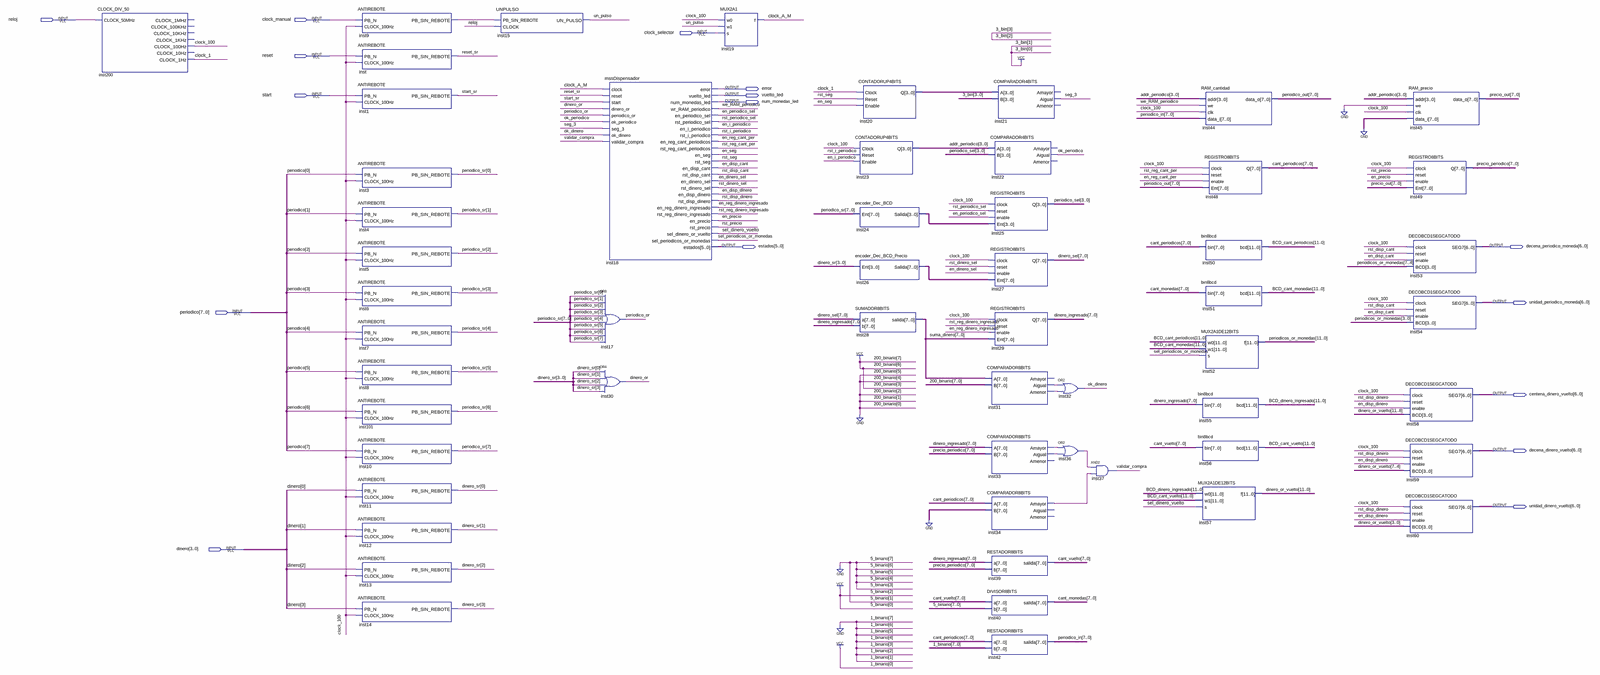
[diagram p0: schematic sheet, whole]
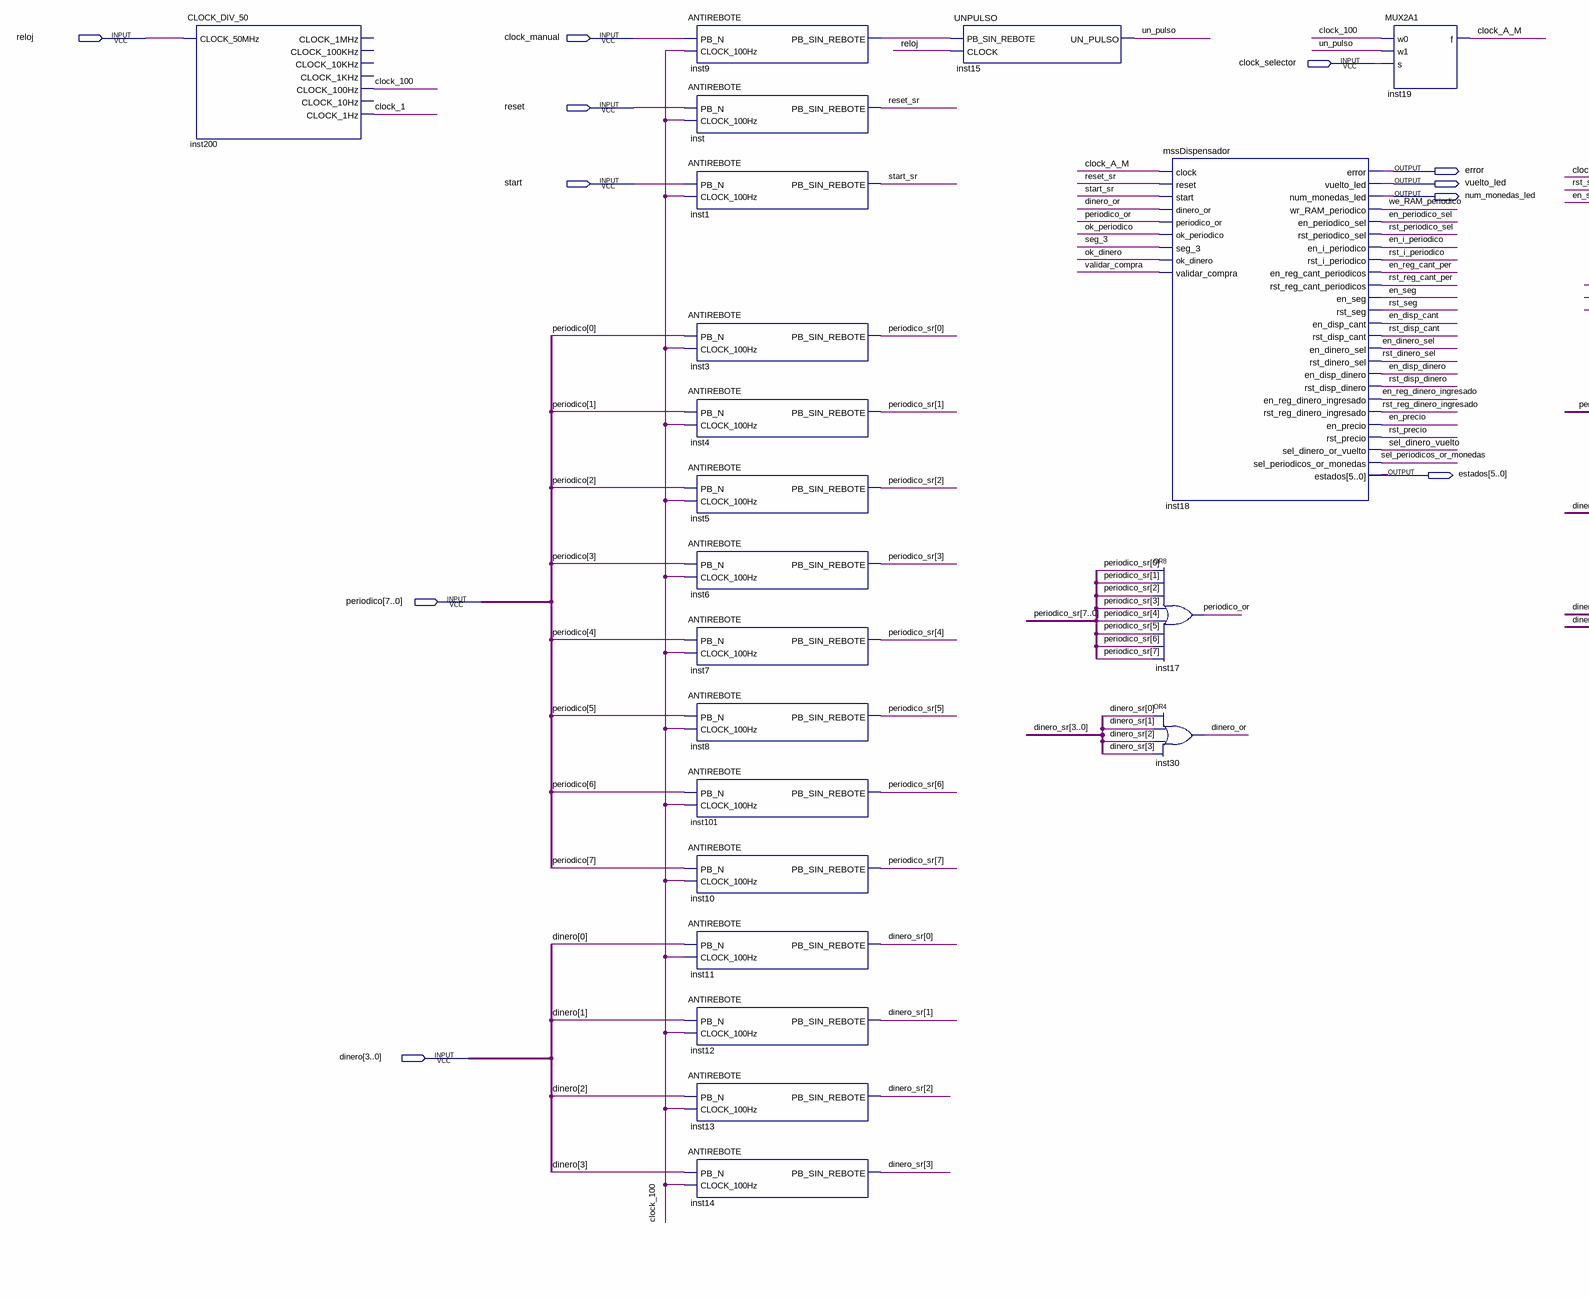
[diagram p1: schematic sheet, left part]
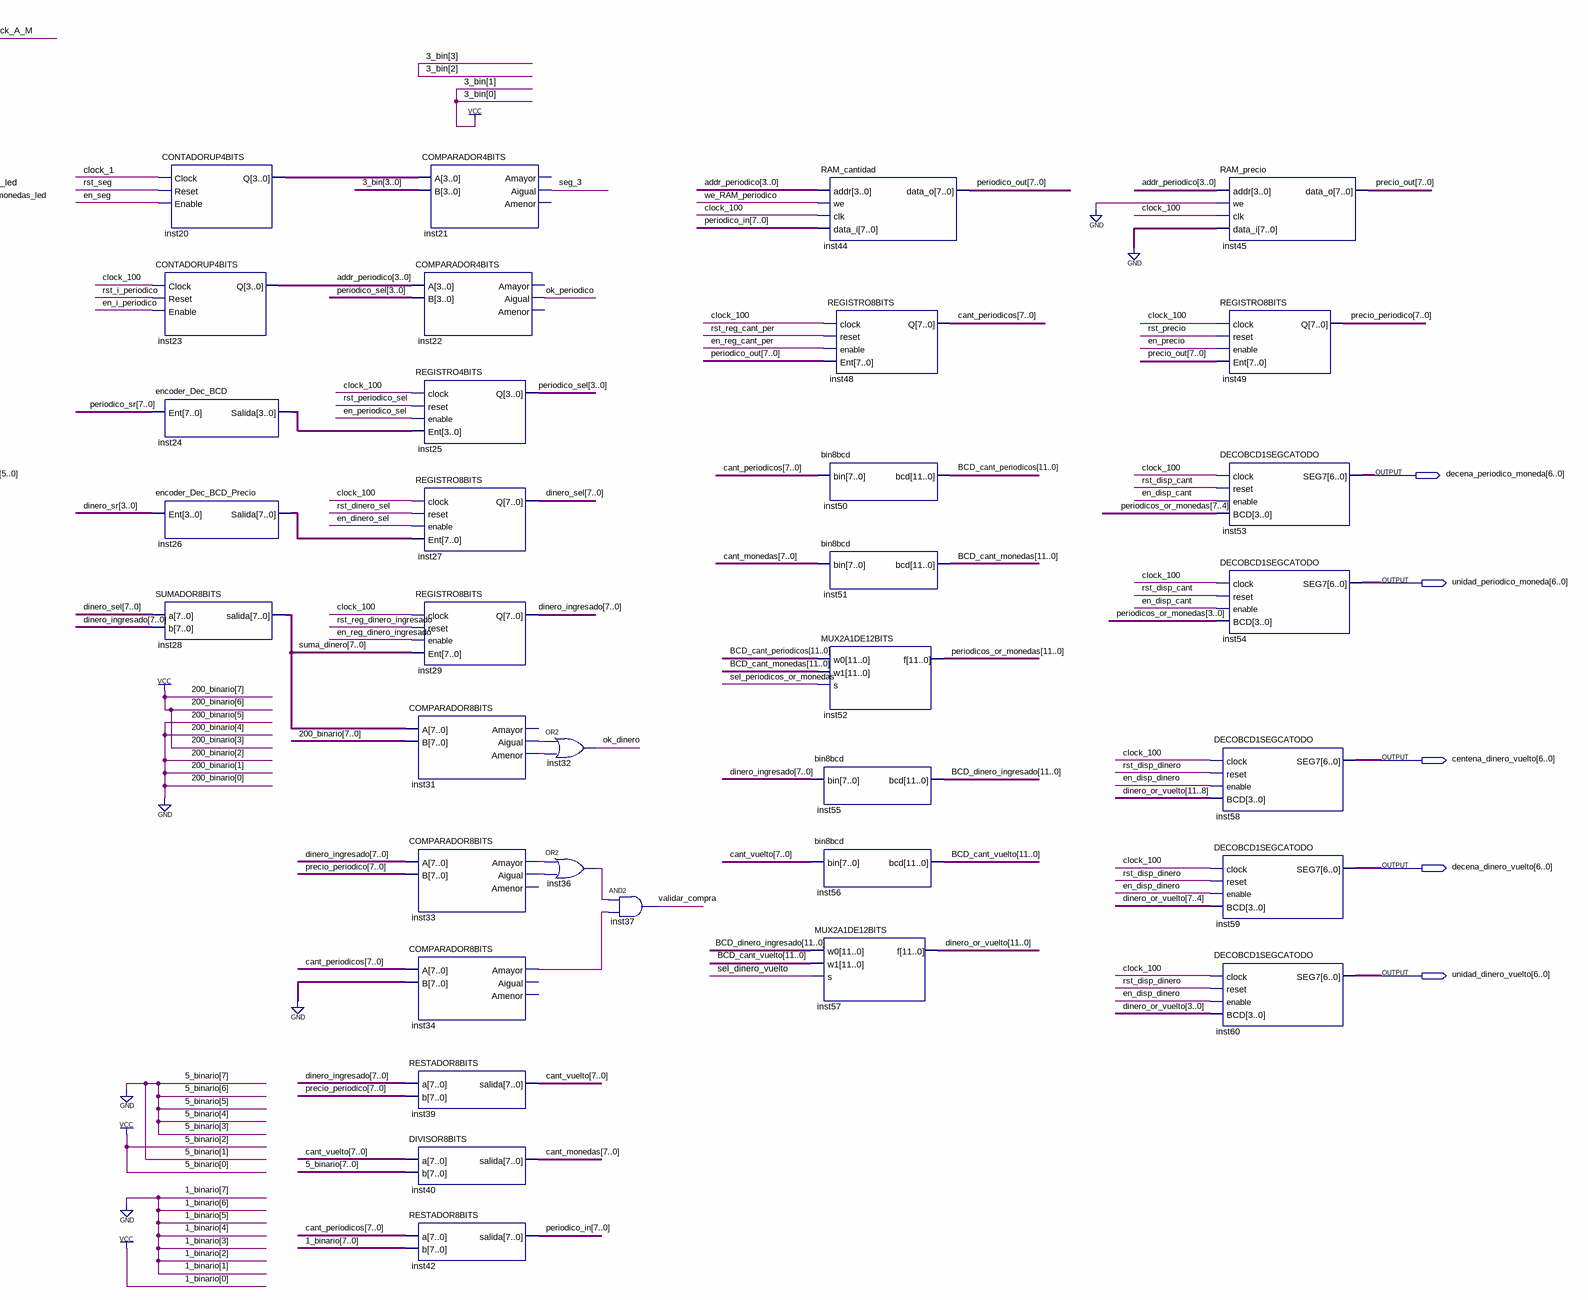
[diagram p2: schematic sheet, right part]
// Quartus schematic proyectoDispensador.bdf as structural Verilog: 55 symbols, 16 pins
module proyectoDispensador (
  input  reloj,
  input  clock_manual,
  input  clock_selector,
  input  reset,
  input  start,
  input  [7:0] periodico,
  input  [3:0] dinero,
  output error,
  output vuelto_led,
  output num_monedas_led,
  output [5:0] estados,
  output [6:0] decena_periodico_moneda,
  output [6:0] unidad_periodico_moneda,
  output [6:0] centena_dinero_vuelto,
  output [6:0] decena_dinero_vuelto,
  output [6:0] unidad_dinero_vuelto
);

  wire clock_1, clock_100, clock_A_M, dinero_or, en_dinero_sel, en_disp_cant, en_disp_dinero, en_i_periodico,
       en_periodico_sel, en_precio, en_reg_cant_per, en_reg_dinero_ingresado, en_seg, inst9_pb_sin_rebote,
       inst31_aigual, inst31_amenor, inst33_aigual, inst33_amayor, inst34_amayor, inst36_out, ok_dinero,
       ok_periodico, periodico_or, reset_sr, rst_dinero_sel, rst_disp_cant, rst_disp_dinero, rst_i_periodico,
       rst_periodico_sel, rst_precio, rst_reg_cant_per, rst_reg_dinero_ingresado, rst_seg, seg_3,
       sel_dinero_vuelto, sel_periodicos_or_monedas, start_sr, un_pulso, validar_compra, we_RAM_periodico;
  wire [3:0] addr_periodico, dinero_sr, inst20_q, inst24_salida, periodico_sel;
  wire [3:3] \3_bin ;
  wire [7:0] cant_monedas, cant_periodicos, cant_vuelto, dinero_ingresado, dinero_sel, inst26_salida,
       periodico_in, periodico_out, periodico_sr, precio_out, precio_periodico, suma_dinero;
  wire [11:0] BCD_cant_monedas, BCD_cant_periodicos, BCD_cant_vuelto, BCD_dinero_ingresado, dinero_or_vuelto,
       periodicos_or_monedas;

  CLOCK_DIV_50 inst200 (
    .CLOCK_50MHz(reloj), .CLOCK_100Hz(clock_100), .CLOCK_1Hz(clock_1));  // open: CLOCK_1MHz, CLOCK_100KHz, CLOCK_10KHz, CLOCK_1KHz, CLOCK_10Hz
  ANTIREBOTE inst9 (.PB_N(clock_manual), .CLOCK_100Hz(clock_100), .PB_SIN_REBOTE(inst9_pb_sin_rebote));
  ANTIREBOTE inst (.PB_N(reset), .CLOCK_100Hz(clock_100), .PB_SIN_REBOTE(reset_sr));
  ANTIREBOTE inst1 (.PB_N(start), .CLOCK_100Hz(clock_100), .PB_SIN_REBOTE(start_sr));
  ANTIREBOTE inst3 (.PB_N(periodico[0]), .CLOCK_100Hz(clock_100), .PB_SIN_REBOTE(periodico_sr[0]));
  ANTIREBOTE inst4 (.PB_N(periodico[1]), .CLOCK_100Hz(clock_100), .PB_SIN_REBOTE(periodico_sr[1]));
  ANTIREBOTE inst5 (.PB_N(periodico[2]), .CLOCK_100Hz(clock_100), .PB_SIN_REBOTE(periodico_sr[2]));
  ANTIREBOTE inst6 (.PB_N(periodico[3]), .CLOCK_100Hz(clock_100), .PB_SIN_REBOTE(periodico_sr[3]));
  ANTIREBOTE inst7 (.PB_N(periodico[4]), .CLOCK_100Hz(clock_100), .PB_SIN_REBOTE(periodico_sr[4]));
  ANTIREBOTE inst8 (.PB_N(periodico[5]), .CLOCK_100Hz(clock_100), .PB_SIN_REBOTE(periodico_sr[5]));
  ANTIREBOTE inst101 (.PB_N(periodico[6]), .CLOCK_100Hz(clock_100), .PB_SIN_REBOTE(periodico_sr[6]));
  ANTIREBOTE inst10 (.PB_N(periodico[7]), .CLOCK_100Hz(clock_100), .PB_SIN_REBOTE(periodico_sr[7]));
  ANTIREBOTE inst11 (.PB_N(dinero[0]), .CLOCK_100Hz(clock_100), .PB_SIN_REBOTE(dinero_sr[0]));
  ANTIREBOTE inst12 (.PB_N(dinero[1]), .CLOCK_100Hz(clock_100), .PB_SIN_REBOTE(dinero_sr[1]));
  ANTIREBOTE inst13 (.PB_N(dinero[2]), .CLOCK_100Hz(clock_100), .PB_SIN_REBOTE(dinero_sr[2]));
  ANTIREBOTE inst14 (.PB_N(dinero[3]), .CLOCK_100Hz(clock_100), .PB_SIN_REBOTE(dinero_sr[3]));
  UNPULSO inst15 (.PB_SIN_REBOTE(inst9_pb_sin_rebote), .CLOCK(reloj), .UN_PULSO(un_pulso));
  mssDispensador inst18 (
    .clock(clock_A_M), .reset(reset_sr), .start(start_sr), .dinero_or(dinero_or),
    .periodico_or(periodico_or), .ok_periodico(ok_periodico), .seg_3(seg_3), .ok_dinero(ok_dinero),
    .validar_compra(validar_compra), .error(error), .vuelto_led(vuelto_led),
    .num_monedas_led(num_monedas_led), .wr_RAM_periodico(we_RAM_periodico),
    .en_periodico_sel(en_periodico_sel), .rst_periodico_sel(rst_periodico_sel),
    .en_i_periodico(en_i_periodico), .rst_i_periodico(rst_i_periodico),
    .en_reg_cant_periodicos(en_reg_cant_per), .rst_reg_cant_periodicos(rst_reg_cant_per), .en_seg(en_seg),
    .rst_seg(rst_seg), .en_disp_cant(en_disp_cant), .rst_disp_cant(rst_disp_cant),
    .en_dinero_sel(en_dinero_sel), .rst_dinero_sel(rst_dinero_sel), .en_disp_dinero(en_disp_dinero),
    .rst_disp_dinero(rst_disp_dinero), .en_reg_dinero_ingresado(en_reg_dinero_ingresado),
    .rst_reg_dinero_ingresado(rst_reg_dinero_ingresado), .en_precio(en_precio), .rst_precio(rst_precio),
    .sel_dinero_or_vuelto(sel_dinero_vuelto), .sel_periodicos_or_monedas(sel_periodicos_or_monedas),
    .estados(estados));
  or inst17 (periodico_or, periodico_sr[0], periodico_sr[1], periodico_sr[2], periodico_sr[3], periodico_sr[4], periodico_sr[5], periodico_sr[6], periodico_sr[7]);
  or inst30 (dinero_or, dinero_sr[0], dinero_sr[1], dinero_sr[2], dinero_sr[3]);
  MUX2A1 inst19 (.w0(clock_100), .w1(un_pulso), .s(clock_selector), .f(clock_A_M));
  CONTADORUP4BITS inst20 (.Clock(clock_1), .Reset(rst_seg), .Enable(en_seg), .Q(inst20_q));
  CONTADORUP4BITS inst23 (.Clock(clock_100), .Reset(rst_i_periodico), .Enable(en_i_periodico), .Q(addr_periodico));
  encoder_Dec_BCD inst24 (.Ent(periodico_sr), .Salida(inst24_salida));
  encoder_Dec_BCD_Precio inst26 (.Ent(dinero_sr), .Salida(inst26_salida));
  SUMADOR8BITS inst28 (.a(dinero_sel), .b(dinero_ingresado), .salida(suma_dinero));
  COMPARADOR4BITS inst21 (.A(inst20_q), .B({{2{\3_bin [3]}}, 2'b11}), .Aigual(seg_3));  // open: Amayor, Amenor
  COMPARADOR4BITS inst22 (.A(addr_periodico), .B(periodico_sel), .Aigual(ok_periodico));  // open: Amayor, Amenor
  REGISTRO4BITS inst25 (
    .clock(clock_100), .reset(rst_periodico_sel), .enable(en_periodico_sel), .Ent(inst24_salida),
    .Q(periodico_sel));
  REGISTRO8BITS inst27 (
    .clock(clock_100), .reset(rst_dinero_sel), .enable(en_dinero_sel), .Ent(inst26_salida), .Q(dinero_sel));
  REGISTRO8BITS inst29 (
    .clock(clock_100), .reset(rst_reg_dinero_ingresado), .enable(en_reg_dinero_ingresado), .Ent(suma_dinero),
    .Q(dinero_ingresado));
  COMPARADOR8BITS inst31 (
    .A(suma_dinero), .B(8'b11001000), .Aigual(inst31_aigual), .Amenor(inst31_amenor));  // open: Amayor
  COMPARADOR8BITS inst33 (
    .A(dinero_ingresado), .B(precio_periodico), .Amayor(inst33_amayor), .Aigual(inst33_aigual));  // open: Amenor
  COMPARADOR8BITS inst34 (.A(cant_periodicos), .B({8{1'b0}}), .Amayor(inst34_amayor));  // open: Aigual, Amenor
  RESTADOR8BITS inst39 (.a(dinero_ingresado), .b(precio_periodico), .salida(cant_vuelto));
  DIVISOR8BITS inst40 (.a(cant_vuelto), .b(8'b00000101), .salida(cant_monedas));
  RESTADOR8BITS inst42 (.a(cant_periodicos), .b(8'b00000001), .salida(periodico_in));
  or inst32 (ok_dinero, inst31_aigual, inst31_amenor);
  or inst36 (inst36_out, inst33_amayor, inst33_aigual);
  and inst37 (validar_compra, inst36_out, inst34_amayor);
  RAM_cantidad inst44 (
    .addr(addr_periodico), .we(we_RAM_periodico), .clk(clock_100), .data_i(periodico_in),
    .data_o(periodico_out));
  REGISTRO8BITS inst48 (
    .clock(clock_100), .reset(rst_reg_cant_per), .enable(en_reg_cant_per), .Ent(periodico_out),
    .Q(cant_periodicos));
  bin8bcd inst50 (.bin(cant_periodicos), .bcd(BCD_cant_periodicos));
  bin8bcd inst51 (.bin(cant_monedas), .bcd(BCD_cant_monedas));
  MUX2A1DE12BITS inst52 (
    .w0(BCD_cant_periodicos), .w1(BCD_cant_monedas), .s(sel_periodicos_or_monedas), .f(periodicos_or_monedas));
  bin8bcd inst55 (.bin(dinero_ingresado), .bcd(BCD_dinero_ingresado));
  bin8bcd inst56 (.bin(cant_vuelto), .bcd(BCD_cant_vuelto));
  MUX2A1DE12BITS inst57 (.w0(BCD_dinero_ingresado), .w1(BCD_cant_vuelto), .s(sel_dinero_vuelto), .f(dinero_or_vuelto));
  DECOBCD1SEGCATODO inst58 (
    .clock(clock_100), .reset(rst_disp_dinero), .enable(en_disp_dinero), .BCD(dinero_or_vuelto[11:8]),
    .SEG7(centena_dinero_vuelto));
  DECOBCD1SEGCATODO inst59 (
    .clock(clock_100), .reset(rst_disp_dinero), .enable(en_disp_dinero), .BCD(dinero_or_vuelto[7:4]),
    .SEG7(decena_dinero_vuelto));
  DECOBCD1SEGCATODO inst60 (
    .clock(clock_100), .reset(rst_disp_dinero), .enable(en_disp_dinero), .BCD(dinero_or_vuelto[3:0]),
    .SEG7(unidad_dinero_vuelto));
  RAM_precio inst45 (.addr(addr_periodico), .we(1'b0), .clk(clock_100), .data_i({8{1'b0}}), .data_o(precio_out));
  REGISTRO8BITS inst49 (
    .clock(clock_100), .reset(rst_precio), .enable(en_precio), .Ent(precio_out), .Q(precio_periodico));
  DECOBCD1SEGCATODO inst53 (
    .clock(clock_100), .reset(rst_disp_cant), .enable(en_disp_cant), .BCD(periodicos_or_monedas[7:4]),
    .SEG7(decena_periodico_moneda));
  DECOBCD1SEGCATODO inst54 (
    .clock(clock_100), .reset(rst_disp_cant), .enable(en_disp_cant), .BCD(periodicos_or_monedas[3:0]),
    .SEG7(unidad_periodico_moneda));

  // Other names for the same wires on the sheet: 3_bin[2] = \3_bin [3]
endmodule
